# EAGLE design sensor-board (EAGLE 9.6.2)
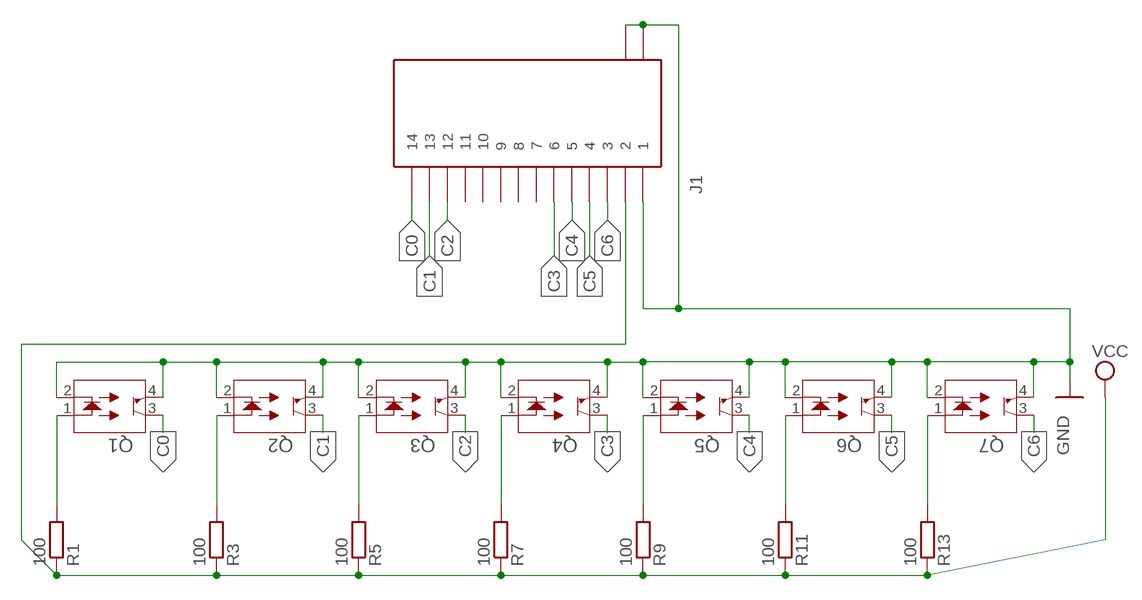
[diagram p0: schematic, sheet 1]

## Parts
J1  686114148922  [686114148922]
Q1  QRE1113  [DIP4_100AQ_ONS]
Q2  QRE1113  [DIP4_100AQ_ONS]
Q3  QRE1113  [DIP4_100AQ_ONS]
Q4  QRE1113  [DIP4_100AQ_ONS]
Q5  QRE1113  [DIP4_100AQ_ONS]
Q6  QRE1113  [DIP4_100AQ_ONS]
Q7  QRE1113  [DIP4_100AQ_ONS]
R1  100  R-EU_R0805  [R0805]
R3  100  R-EU_R0805  [R0805]
R5  100  R-EU_R0805  [R0805]
R7  100  R-EU_R0805  [R0805]
R9  100  R-EU_R0805  [R0805]
R11  100  R-EU_R0805  [R0805]
R13  100  R-EU_R0805  [R0805]

## Nets
C0: J1.14 Q1.3
C1: J1.13 Q2.3
C2: J1.12 Q3.3
C3: J1.6 Q4.3
C4: J1.5 Q5.3
C5: J1.4 Q6.3
C6: J1.3 Q7.3
GND: J1.1 J1.MP1 J1.MP2 Q1.2 Q1.4 Q2.2 Q2.4 Q3.2 Q3.4 Q4.2 Q4.4 Q5.2 Q5.4 Q6.2 Q6.4 Q7.2 Q7.4
N$1: Q1.1 R1.2
N$3: Q2.1 R3.2
N$4: Q5.1 R9.2
N$5: Q3.1 R5.2
N$7: Q4.1 R7.2
N$11: Q6.1 R11.2
N$13: Q7.1 R13.2
VCC: J1.2 R1.1 R3.1 R5.1 R7.1 R9.1 R11.1 R13.1
Unconnected: J1.7 J1.8 J1.9 J1.10 J1.11

## Library data of the parts
J1 = 686114148922:686114148922: Wurth Elektronik WR-FPC 1mm Pitch 14 Way Horizontal SMT Female FPC Connector, ZIF Bottom Contact Source: Datasheet <https://www.we-online.com/catalog/datasheet/686114148922.pdf>; DESCRIPTION: Wurth Elektronik WR-FPC 1mm Pitch 14 Way Horizontal SMT Female FPC Connector, ZIF Bottom Contact; HEIGHT: 2.3mm; MANUFACTURER_NAME: Wurth Elektronik; MANUFACTURER_PART_NUMBER: 686114148922; MOUSER_PART_NUMBER: 710-686114148922; MOUSER_PRICE-STOCK: https://www.mouser.co.uk/ProductDetail/Wurth-Elektronik/686114148922?qs=a9WhcLg8qCz0mPj5zZqo5g%3D%3D
Q1-Q7 = qre1113:QRE1113; COPYRIGHT: Copyright (C) 2024 Ultra Librarian. All rights reserved.; MANUFACTURER_PART_NUMBER: QRE1113; MFR_NAME: onsemi
R1 R3 R5 R7 R9 R11 R13 = rcl:R-EU_: RESISTOR, European symbol; SPICEPREFIX: R

## Board
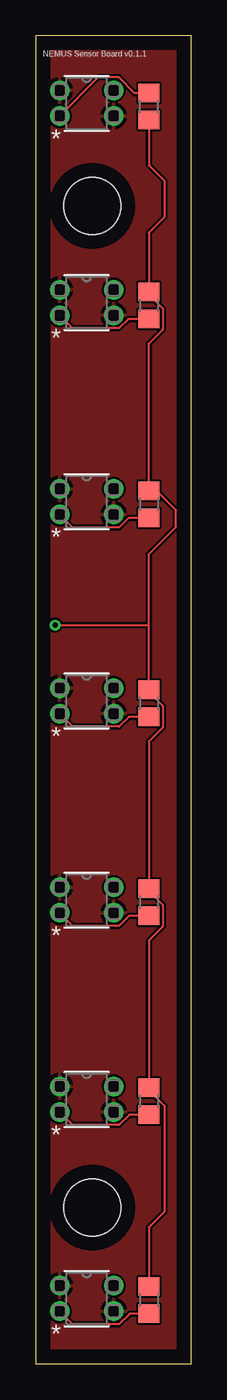
[diagram p1: board, top side]
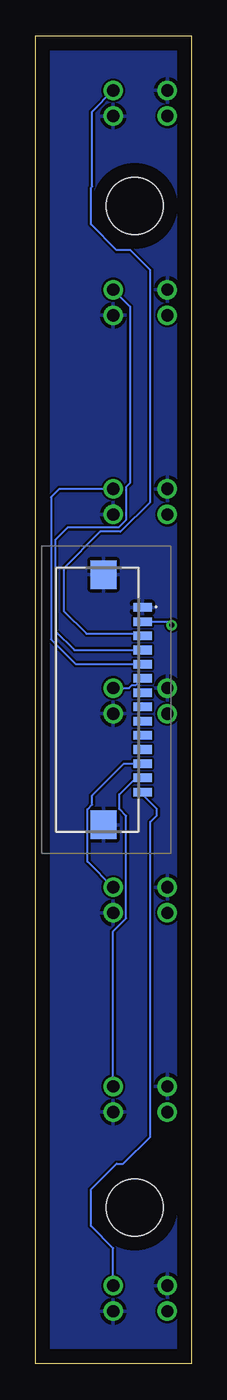
[diagram p2: board, bottom side, seen from below]

Size 11 x 93.5 mm. Coordinates in mm from the lower left corner, seen from the top.
Outline: 0,0 11,0 11,93.5 0,93.5 0,0
Copper layers (1*16): Top 0.035mm / dielectric 1.5mm / Bottom 0.035mm
Design rules "default": minimum track width 6mil, minimum drill 0.35mm, track to track 6mil, track to pad 6mil, pad to pad 6mil, via to via 6mil, smd to smd 6mil, copper to edge 40mil, drill to drill 6mil, minimum pad ring 10mil, minimum via ring 8mil, stop-mask expansion 4mil, vias tented up to drill 0mil, thermal gap 10mil
Holes 4 mm at 4,11 4,81.5

### Footprints (pad centres in the part's own frame; a part is rotated, then mirrored left to right if it is on the bottom)
686114148922 = smd 0.6 x 1.3: 1 -6.5,3.05; 2 -5.5,3.05; 3 -4.5,3.05; 4 -3.5,3.05; 5 -2.5,3.05; 6 -1.5,3.05; 7 -0.5,3.05; 8 0.5,3.05; 9 1.5,3.05; 10 2.5,3.05; 11 3.5,3.05; 12 4.5,3.05; 13 5.5,3.05; 14 6.5,3.05 | smd 2 x 1.8: MP1 -8.8,0.3; MP2 8.8,0.3
DIP4_100AQ_ONS = drill 0.864 pad 1.372: 1 0,0; 2 3.81,0; 3 3.81,1.803; 4 0,1.803
R0805 = smd 1.3 x 1.5: 1 -0.95,0; 2 0.95,0

### Placement (x,y rotation side)
J1  6.5,46.75 270 bottom
Q1  1.71,3.71 0 top
Q2  1.71,17.73 0 top
Q3  1.71,31.75 0 top
Q4  1.71,45.77 0 top
Q5  1.71,59.79 0 top
Q6  1.71,73.81 0 top
Q7  1.71,87.83 0 top
R1  8,4.5 270 top
R3  8,18.5 270 top
R5  8,32.5 270 top
R7  8,46.5 270 top
R9  8,60.5 270 top
R11  8,74.5 270 top
R13  8,88.5 90 top

### Tracks (layer width: path | path; a pad name or v marks a point on that pad's centre or on a via)
C0
  Bottom 0.152: J1.14 3.45,40.07 2.44,39.07 2.44,38.62 2.91,38.16 2.91,16 4.82,14.09 5.28,14.09 7.09,12.28 7.09,9.72 5.51,8.14 Q1.3
C1
  Bottom 0.152: J1.13 3.93,41.25 5.09,40.09 5.09,39.06 4.6,38.57 4.6,31.37 5.51,30.46 Q2.3
C2
  Bottom 0.152: Q3.3 7.33,35.37 7.33,39.05 7,39.37 7,40 4.75,42.25 J1.12
C3
  Bottom 0.152: J1.6 3.92,47.78 4.2,47.78 4.4,47.57 Q4.3
C4
  Bottom 0.152: Q5.3 9.31,61.59 9.91,61 9.91,51 8.16,49.25 J1.5
C5
  Bottom 0.152: Q6.3 4.33,74.43 4.33,62 4.6,61.73 4.6,59.41 5.14,58.88 8.73,58.88 9.6,58 9.6,51.6 8.25,50.25 J1.4
C6
  Bottom 0.152: J1.3 3.6,51.4 7.4,51.4 9,53 9,56 6.43,58.57 5.01,58.57 2.91,60.67 2.91,77 4.32,78.41 5.28,78.41 7.09,80.22 7.09,82.78 7,82.87 7,88.15 Q7.3
GND
  pour Top: 0,93.5 11,93.5 11,0 0,0
  pour Bottom: 11,93.5 0,93.5 0,0 11,0
N$1
  Top 0.152: R1.2 6.65,3.55 5.89,2.8 2.62,2.8 Q1.1
N$3
  Top 0.152: R3.2 6.63,17.55 5.89,16.82 2.62,16.82 Q2.1
N$4
  Top 0.152: R9.2 6.57,59.55 5.89,58.88 2.62,58.88 Q5.1
N$5
  Top 0.152: R5.2 6.61,31.55 5.89,30.84 2.62,30.84 Q3.1
N$7
  Top 0.152: R7.2 6.59,45.55 5.89,44.86 2.62,44.86 Q4.1
N$11
  Top 0.152: R11.2 6.55,73.55 5.89,72.9 2.62,72.9 Q6.1
N$13
  Top 0.152: R13.2 6.99,89.45 5.89,90.55 4.42,90.55 Q7.1
VCC  (via drill 0.35)
  Top 0.152: R13.1 8,84.37 9.09,83.28 9.09,80.72 8,79.63 R11.1 8,75.27 8.98,74.3 8.98,72.81 8,71.83 8,62 | 8,52 R7.1 8,47.27 8.98,46.3 8.98,44.8 8,43.83 R5.1 8,33.27 8.98,32.3 8.98,30.8 8,29.83 R3.1 8,19.27 9.09,18.18 9.09,10.72 8,9.63 R1.1 | 8,52 8,57 9.91,58.91 9.91,60.09 8.55,61.45 | 8.55,61.45 8,62 | v1.39,52 8,52 | 8.55,61.45 R9.1 8,62
  Bottom 0.152: J1.2 1.64,52.25 v1.39,52

### Text on the board
tNames: NEMUS Sensor Board v0.1.1